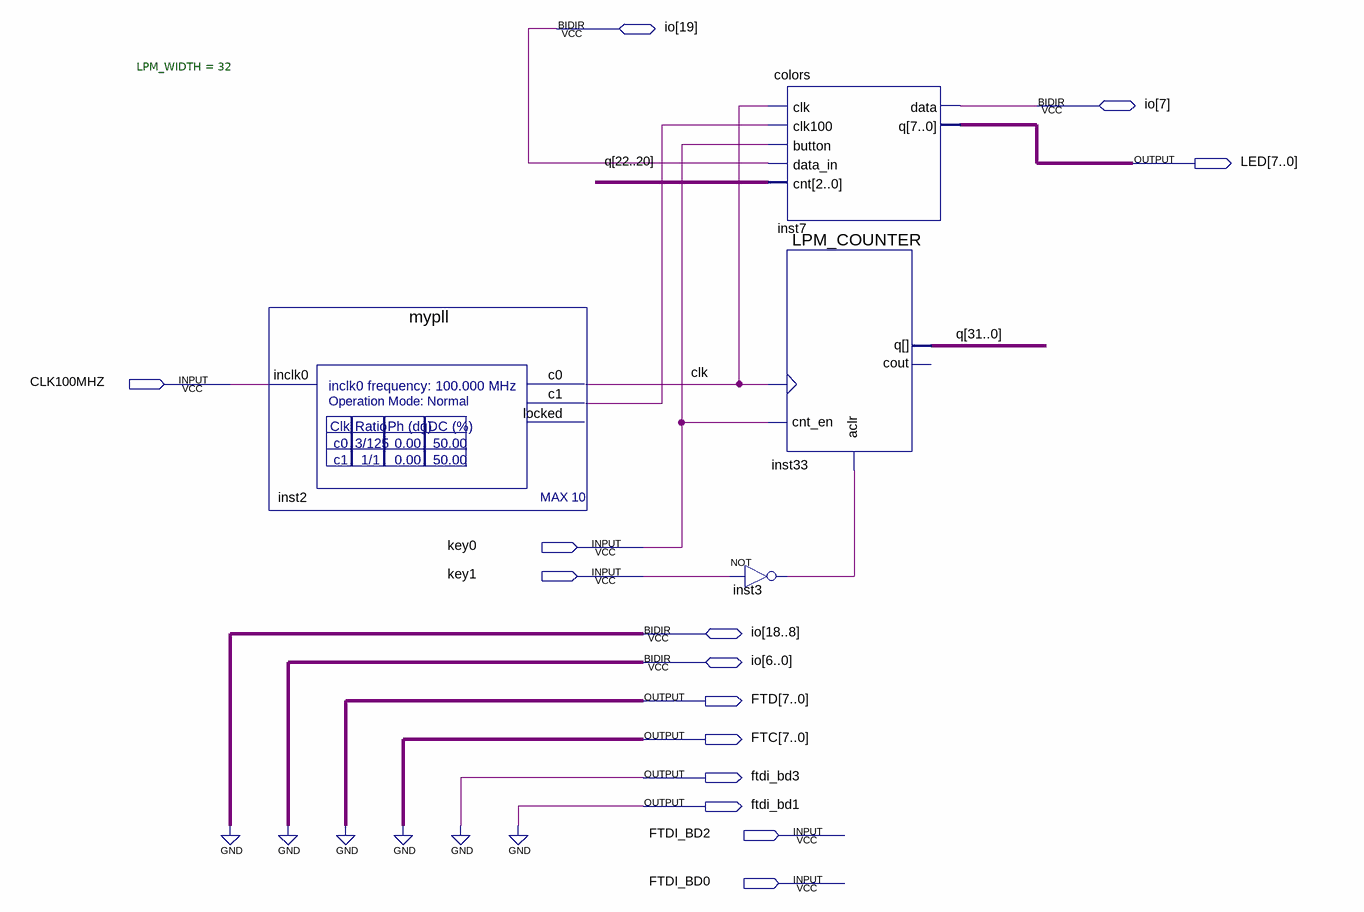
[diagram p0: schematic sheet]
// Quartus schematic max10.bdf as structural Verilog: 4 symbols, 14 pins
module max10 (
  input  CLK100MHZ,
  input  key0,
  input  key1,
  input  FTDI_BD2,
  input  FTDI_BD0,
  inout  [19:0] io,
  output [7:0] LED,
  output [7:0] FTD,
  output [7:0] FTC,
  output ftdi_bd3,
  output ftdi_bd1
);

  wire clk, inst2_c1, inst3_out;
  wire [31:0] q;

  mypll inst2 (.inclk0(CLK100MHZ), .c0(clk), .c1(inst2_c1));  // open: locked
  colors inst7 (.clk(clk), .clk100(inst2_c1), .button(key0), .data_in(io[19]), .cnt(q[22:20]), .data(io[7]), .q(LED));
  LPM_COUNTER #(.LPM_WIDTH(32)) inst33 (.aclr(inst3_out), .clock(clk), .cnt_en(key0), .q(q));  // open: cout
  not inst3 (inst3_out, key1);

  assign FTC = {8{1'b0}};
  assign FTD = {8{1'b0}};
  assign ftdi_bd1 = 1'b0;
  assign ftdi_bd3 = 1'b0;
  // also tied to GND on the sheet: {io[0], io[1], io[2], io[3], io[4], io[5], io[6], io[8], io[9], io[10], io[11], io[12], io[13], io[14], io[15], io[16], io[17], io[18]}
endmodule
